# EAGLE design input (EAGLE 9.6.2)
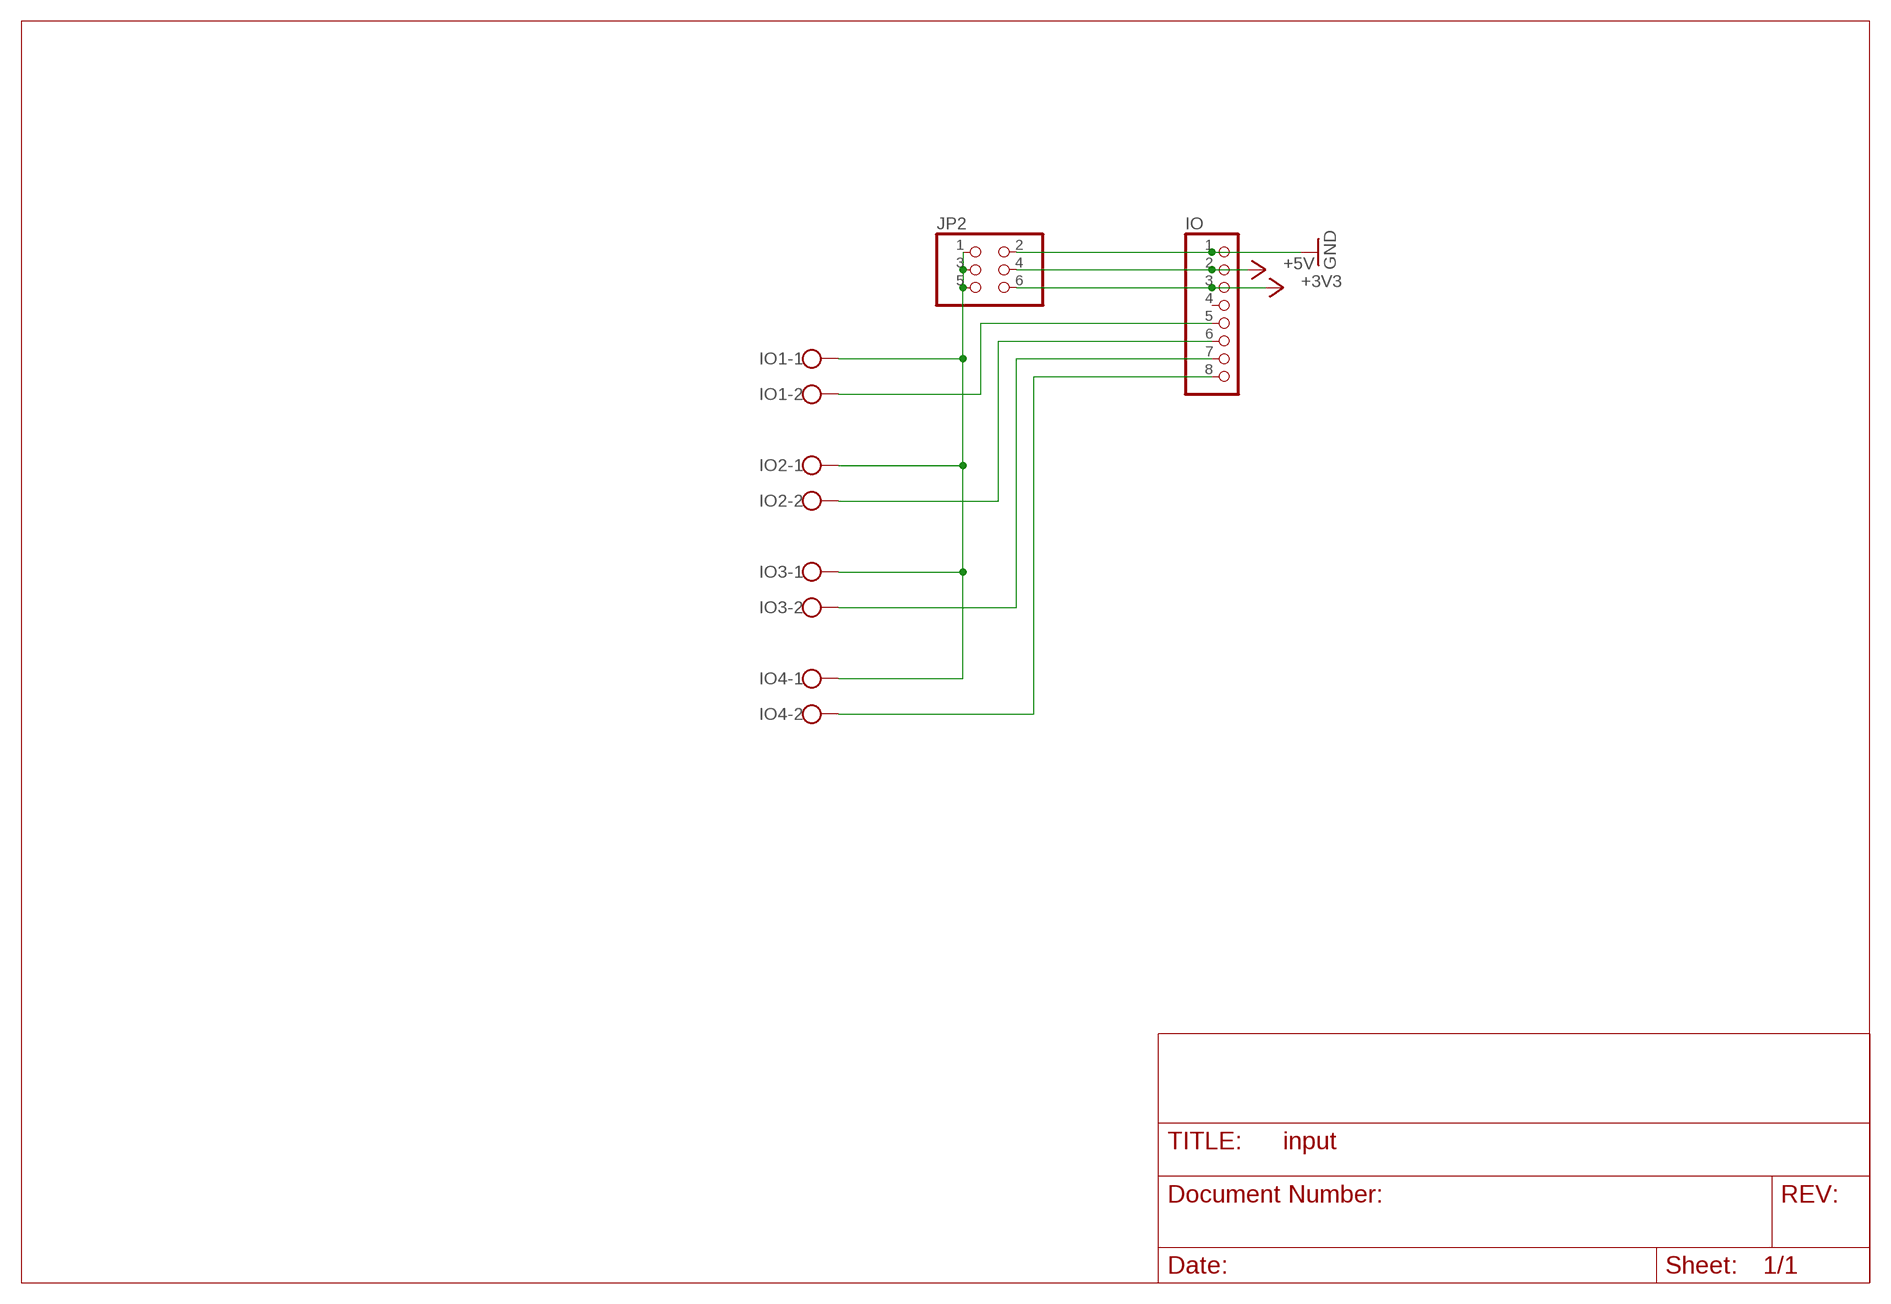
[diagram p0: schematic, sheet 1]

## Parts
IO  PINHD-1X8  [1X08]
IO1  W237-102  [W237-102]
IO2  W237-102  [W237-102]
IO3  W237-102  [W237-102]
IO4  W237-102  [W237-102]
JP2  PINHD-2X3  [2X03]

## Nets
+3V3: IO.3 JP2.6
+5V: IO.2 JP2.4
GND: IO.1 JP2.2
IO1: IO1.2 IO.5
IO2: IO2.2 IO.6
IO3: IO3.2 IO.7
IO4: IO4.2 IO.8
N$1: IO1.1 IO2.1 IO3.1 IO4.1 JP2.1 JP2.3 JP2.5
Unconnected: IO.4

## Library data of the parts
IO = pinhead:PINHD-1X8: PIN HEADER
IO1-IO4 = con-wago-500:W237-102: WAGO SCREW CLAMP; MPN: 237-102; OC_FARNELL: unknown; OC_NEWARK: 70K9898
JP2 = pinhead:PINHD-2X3: PIN HEADER

## Board
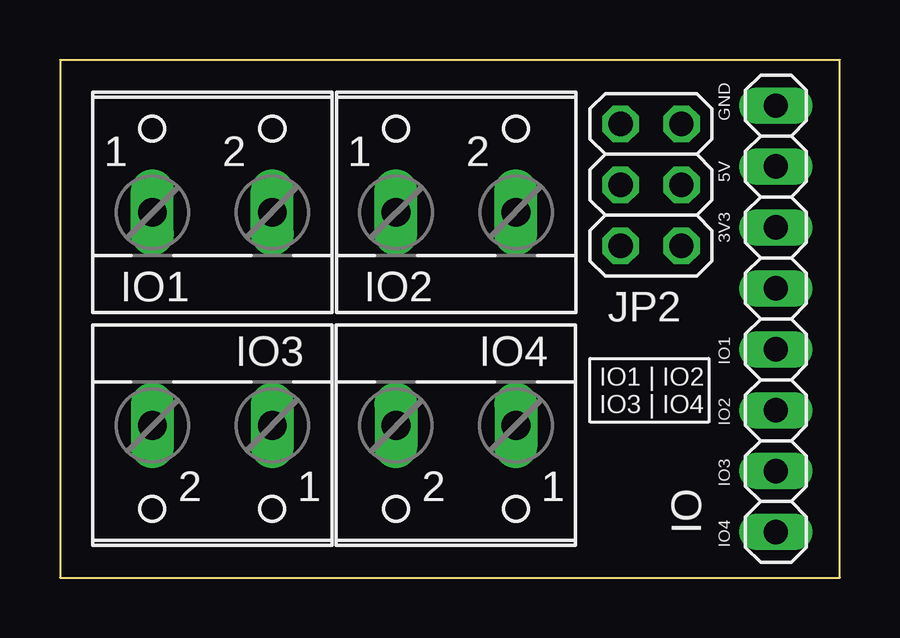
[diagram p1: board, top side]
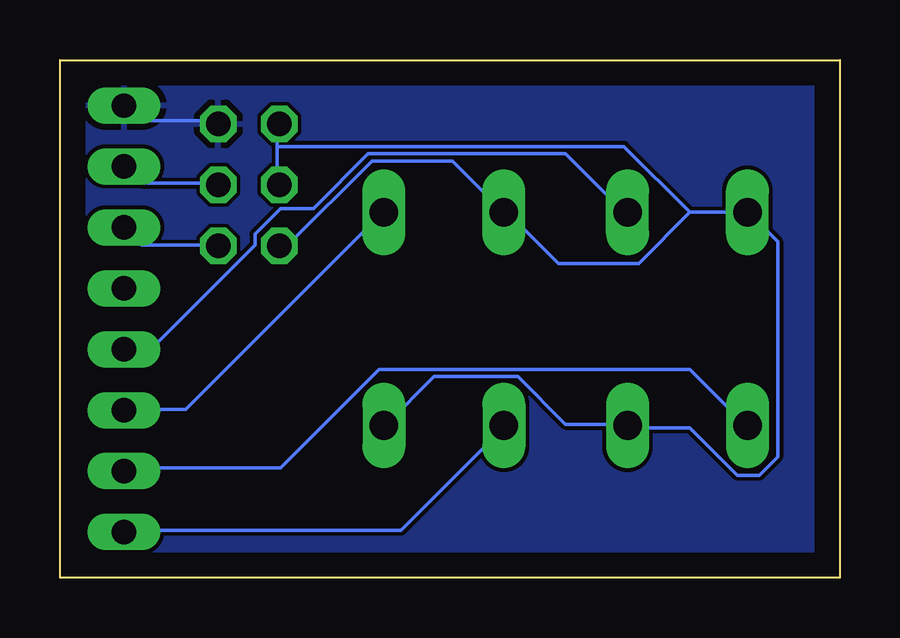
[diagram p2: board, bottom side, seen from below]

Size 32.51 x 21.59 mm. Coordinates in mm from the lower left corner, seen from the top.
Outline: 0,0 32.51,0 32.51,21.59 0,21.59 0,0
Copper layers (1*16): Top 0.035mm / dielectric 1.5mm / Bottom 0.035mm
Design rules "default": minimum track width 6mil, minimum drill 0.35mm, track to track 6mil, track to pad 6mil, pad to pad 6mil, via to via 6mil, smd to smd 6mil, copper to edge 40mil, drill to drill 6mil, minimum pad ring 10mil, minimum via ring 8mil, stop-mask expansion 4mil, vias tented up to drill 0mil, thermal gap 10mil

### Footprints (pad centres in the part's own frame; a part is rotated, then mirrored left to right if it is on the bottom)
1X08 = drill 1.016 long: 1 -8.89,0; 2 -6.35,0; 3 -3.81,0; 4 -1.27,0; 5 1.27,0; 6 3.81,0; 7 6.35,0; 8 8.89,0
W237-102 = drill 1.194 long: 1 -2.5,-1.27; 2 2.5,-1.27
2X03 = drill 1.016 octagon: 1 -2.54,-1.27; 2 -2.54,1.27; 3 0,-1.27; 4 0,1.27; 5 2.54,-1.27; 6 2.54,1.27

### Placement (x,y rotation side)
IO  29.84,10.79 270 top
IO1  6.35,16.51 0 top
IO2  16.51,16.51 0 top
IO3  6.35,5.08 180 top
IO4  16.51,5.08 180 top
JP2  24.64,16.38 270 top

### Tracks (layer width: path | path; a pad name or v marks a point on that pad's centre or on a via)
+3V3
  Bottom 0.152: IO.3 29.11,13.87 25.91,13.87 JP2.6
+5V
  Bottom 0.152: JP2.4 25.91,16.46 29.11,16.46 29.72,17.07 IO.2
GND
  Bottom 0.152: JP2.2 25.91,19.05 29.11,19.05 29.72,19.66 IO.1
  pour Bottom: 0,0 0,21.59 32.51,21.59 32.51,0
IO1
  Bottom 0.152: IO.5 29.72,9.6 28.65,9.6 24.38,13.87 24.38,14.33 23.32,15.39 21.95,15.39 19.66,17.68 11.43,17.68 8.99,15.24 IO1.2
IO2
  Bottom 0.152: IO.6 29.72,7.01 27.28,7.01 19.05,15.24 IO2.2
IO3
  Bottom 0.152: IO.7 29.72,4.57 23.32,4.57 19.2,8.69 6.25,8.69 3.96,6.4 IO3.2
IO4
  Bottom 0.152: IO.8 29.72,1.98 18.29,1.98 14.02,6.25 IO4.2
N$1
  Bottom 0.152: IO4.1 18.9,6.4 16.92,8.38 13.41,8.38 11.43,6.4 8.99,6.4 IO3.1 8.84,6.25 6.25,6.25 4.27,4.27 3.35,4.27 2.59,5.03 2.59,14.02 3.81,15.24 IO1.1 6.25,15.24 | 23.47,17.98 23.47,18.9 JP2.1 | 23.47,17.98 23.47,16.46 JP2.3 | JP2.5 23.32,13.87 23.01,13.87 19.51,17.37 16.15,17.37 14.02,15.24 IO2.1 13.87,15.24 11.73,13.11 8.38,13.11 6.25,15.24 | 23.47,17.98 8.99,17.98 6.25,15.24

### Text on the board
tNames: GND | 5V | 3V3 | IO1 | IO1 | IO2 / IO3 | IO4 | IO2 | IO3 | IO4